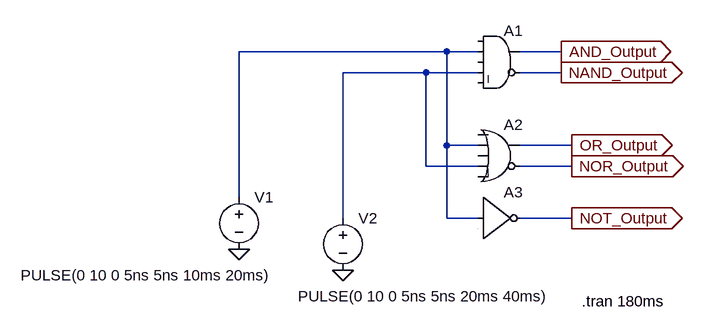
[diagram p0: schematic basic&unigates.asc]
basic&unigates.asc, the LTspice schematic file:
Version 4
SHEET 1 944 680
WIRE 544 -32 224 -32
WIRE 592 -32 544 -32
WIRE 720 -32 656 -32
WIRE 512 0 384 0
WIRE 592 0 512 0
WIRE 720 0 656 0
WIRE 544 112 544 -32
WIRE 592 112 544 112
WIRE 736 112 656 112
WIRE 512 144 512 0
WIRE 592 144 512 144
WIRE 736 144 656 144
WIRE 224 192 224 -32
WIRE 384 224 384 0
WIRE 544 224 544 112
WIRE 592 224 544 224
WIRE 736 224 656 224
FLAG 720 -32 AND_Output
IOPIN 720 -32 Out
FLAG 720 0 NAND_Output
IOPIN 720 0 Out
FLAG 736 112 OR_Output
IOPIN 736 112 Out
FLAG 736 144 NOR_Output
IOPIN 736 144 Out
FLAG 736 224 NOT_Output
IOPIN 736 224 Out
FLAG 224 272 0
FLAG 384 304 0
SYMBOL Digital\\and 624 -80 R0
SYMATTR InstName A1
SYMBOL voltage 224 176 R0
WINDOW 3 -336 136 Left 2
WINDOW 123 0 0 Left 0
WINDOW 39 0 0 Left 0
SYMATTR InstName V1
SYMATTR Value PULSE(0 10 0 5ns 5ns 10ms 20ms)
SYMBOL voltage 384 208 R0
WINDOW 3 -69 136 Left 2
WINDOW 123 0 0 Left 0
WINDOW 39 0 0 Left 0
SYMATTR InstName V2
SYMATTR Value PULSE(0 10 0 5ns 5ns 20ms 40ms)
SYMBOL Digital\\or 624 64 R0
SYMATTR InstName A2
SYMBOL Digital\\inv 592 160 R0
SYMATTR InstName A3
TEXT 752 352 Left 2 !.tran 180ms

The netlist it stands for:
* basic&unigates.asc
A1 0 N001 0 N002 0 NAND_Output AND_Output 0 AND
V1 N001 0 PULSE(0 10 0 5ns 5ns 10ms 20ms)
V2 N002 0 PULSE(0 10 0 5ns 5ns 20ms 40ms)
A2 0 N001 0 N002 0 NOR_Output OR_Output 0 OR
A3 N001 0 0 0 0 NOT_Output 0 0 BUF
.tran 180ms
.backanno
.end